# Altium schematic sheet Top Level Schematic.SchDoc
size A; DocumentNumber: 1; SheetNumber: 1; SheetTotal: 9
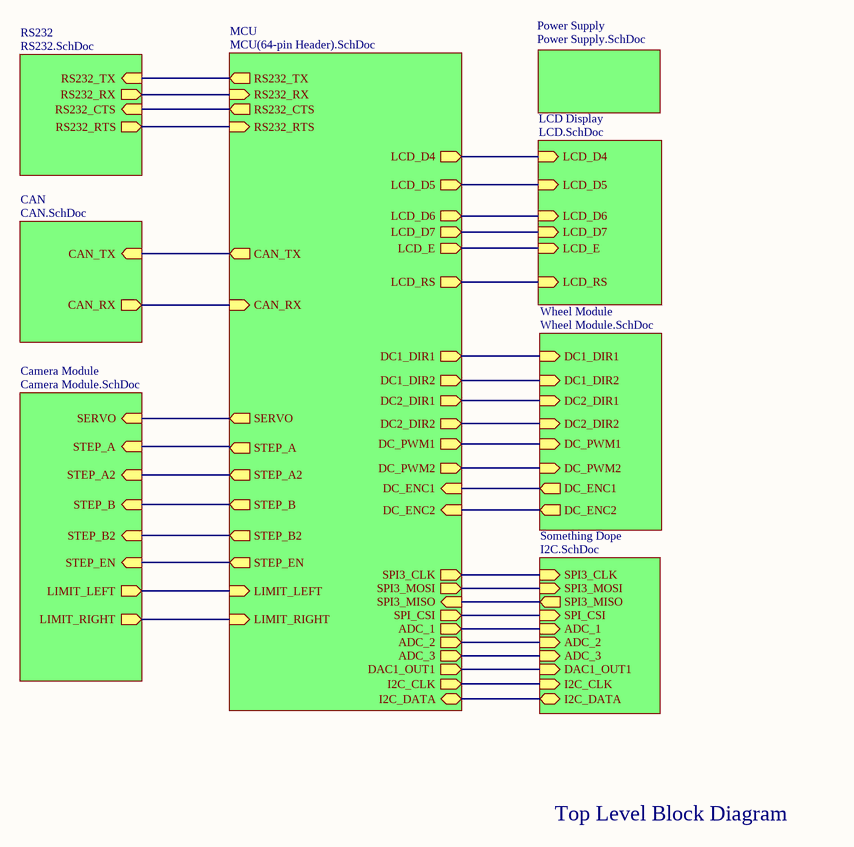
[diagram p0: Top Level Schematic.SchDoc]

## Sub-sheets
Camera Module = Camera Module.SchDoc: SERVO (in), STEP_A (in), STEP_A2 (in), STEP_B (in), STEP_B2 (in), STEP_EN (in), LIMIT_LEFT (out), LIMIT_RIGHT (out)
CAN = CAN.SchDoc: CAN_TX (in), CAN_RX (out)
LCD Display = LCD.SchDoc: LCD_D4 (in), LCD_D5 (in), LCD_D6 (in), LCD_E (in), LCD_RS (in), LCD_D7 (in)
MCU = MCU(64-pin Header).SchDoc: RS232_TX (out), RS232_RX (in), RS232_CTS (out), RS232_RTS (in), SERVO (out), STEP_A (out), STEP_A2 (out), STEP_B (out), STEP_B2 (out), STEP_EN (out), DC1_DIR1 (out), DC1_DIR2 (out), DC2_DIR1 (out), DC2_DIR2 (out), DC_PWM1 (out), DC_PWM2 (out), DC_ENC1 (in), DC_ENC2 (in), LIMIT_LEFT (in), LIMIT_RIGHT (in), CAN_TX (out), CAN_RX (in), LCD_D4 (out), LCD_D5 (out), LCD_D6 (out), LCD_E (out), LCD_RS (out), ADC_1 (out), ADC_2 (out), ADC_3 (out), DAC1_OUT1 (out), SPI_CSI (out), SPI3_MISO (in), SPI3_MOSI (out), SPI3_CLK (out), LCD_D7 (out), I2C_CLK (out), I2C_DATA (bidir)
Power Supply = Power Supply.SchDoc: no entries
RS232 = RS232.SchDoc: RS232_TX (in), RS232_RX (out), RS232_CTS (in), RS232_RTS (out)
Something Dope = I2C.SchDoc: SPI3_CLK (in), SPI3_MOSI (in), SPI3_MISO (out), SPI_CSI (in), ADC_1 (in), ADC_2 (in), ADC_3 (in), DAC1_OUT1 (in), I2C_CLK (in), I2C_DATA (bidir)
Wheel Module = Wheel Module.SchDoc: DC1_DIR1 (in), DC1_DIR2 (in), DC2_DIR1 (in), DC2_DIR2 (in), DC_PWM1 (in), DC_PWM2 (in), DC_ENC1 (out), DC_ENC2 (out)

## Nets
(unnamed): sheet RS232/RS232_TX, sheet MCU/RS232_TX
(unnamed): sheet RS232/RS232_RX, sheet MCU/RS232_RX
(unnamed): sheet RS232/RS232_CTS, sheet MCU/RS232_CTS
(unnamed): sheet RS232/RS232_RTS, sheet MCU/RS232_RTS
(unnamed): sheet MCU/SERVO, sheet Camera Module/SERVO
(unnamed): sheet MCU/STEP_A, sheet Camera Module/STEP_A
(unnamed): sheet MCU/STEP_A2, sheet Camera Module/STEP_A2
(unnamed): sheet MCU/STEP_B, sheet Camera Module/STEP_B
(unnamed): sheet MCU/STEP_B2, sheet Camera Module/STEP_B2
(unnamed): sheet MCU/STEP_EN, sheet Camera Module/STEP_EN
(unnamed): sheet MCU/DC1_DIR1, sheet Wheel Module/DC1_DIR1
(unnamed): sheet MCU/DC1_DIR2, sheet Wheel Module/DC1_DIR2
(unnamed): sheet MCU/DC2_DIR1, sheet Wheel Module/DC2_DIR1
(unnamed): sheet MCU/DC2_DIR2, sheet Wheel Module/DC2_DIR2
(unnamed): sheet MCU/DC_PWM1, sheet Wheel Module/DC_PWM1
(unnamed): sheet MCU/DC_PWM2, sheet Wheel Module/DC_PWM2
(unnamed): sheet MCU/DC_ENC1, sheet Wheel Module/DC_ENC1
(unnamed): sheet MCU/DC_ENC2, sheet Wheel Module/DC_ENC2
(unnamed): sheet MCU/LIMIT_LEFT, sheet Camera Module/LIMIT_LEFT
(unnamed): sheet MCU/LIMIT_RIGHT, sheet Camera Module/LIMIT_RIGHT
(unnamed): sheet MCU/CAN_TX, sheet CAN/CAN_TX
(unnamed): sheet MCU/CAN_RX, sheet CAN/CAN_RX
(unnamed): sheet MCU/LCD_D4, sheet LCD Display/LCD_D4
(unnamed): sheet MCU/LCD_D5, sheet LCD Display/LCD_D5
(unnamed): sheet MCU/LCD_D6, sheet LCD Display/LCD_D6
(unnamed): sheet MCU/LCD_E, sheet LCD Display/LCD_E
(unnamed): sheet MCU/LCD_RS, sheet LCD Display/LCD_RS
(unnamed): sheet MCU/ADC_1, sheet Something Dope/ADC_1
(unnamed): sheet MCU/ADC_2, sheet Something Dope/ADC_2
(unnamed): sheet MCU/ADC_3, sheet Something Dope/ADC_3
(unnamed): sheet MCU/DAC1_OUT1, sheet Something Dope/DAC1_OUT1
(unnamed): sheet MCU/SPI_CSI, sheet Something Dope/SPI_CSI
(unnamed): sheet MCU/SPI3_MISO, sheet Something Dope/SPI3_MISO
(unnamed): sheet MCU/SPI3_MOSI, sheet Something Dope/SPI3_MOSI
(unnamed): sheet MCU/SPI3_CLK, sheet Something Dope/SPI3_CLK
(unnamed): sheet MCU/LCD_D7, sheet LCD Display/LCD_D7
(unnamed): sheet MCU/I2C_CLK, sheet Something Dope/I2C_CLK
(unnamed): sheet MCU/I2C_DATA, sheet Something Dope/I2C_DATA

## Notes on the sheet
- Top Level Block Diagram